# EAGLE design Pluvion 2 - Rev G (EAGLE 7.6.0)

## Sheet 1 of 3
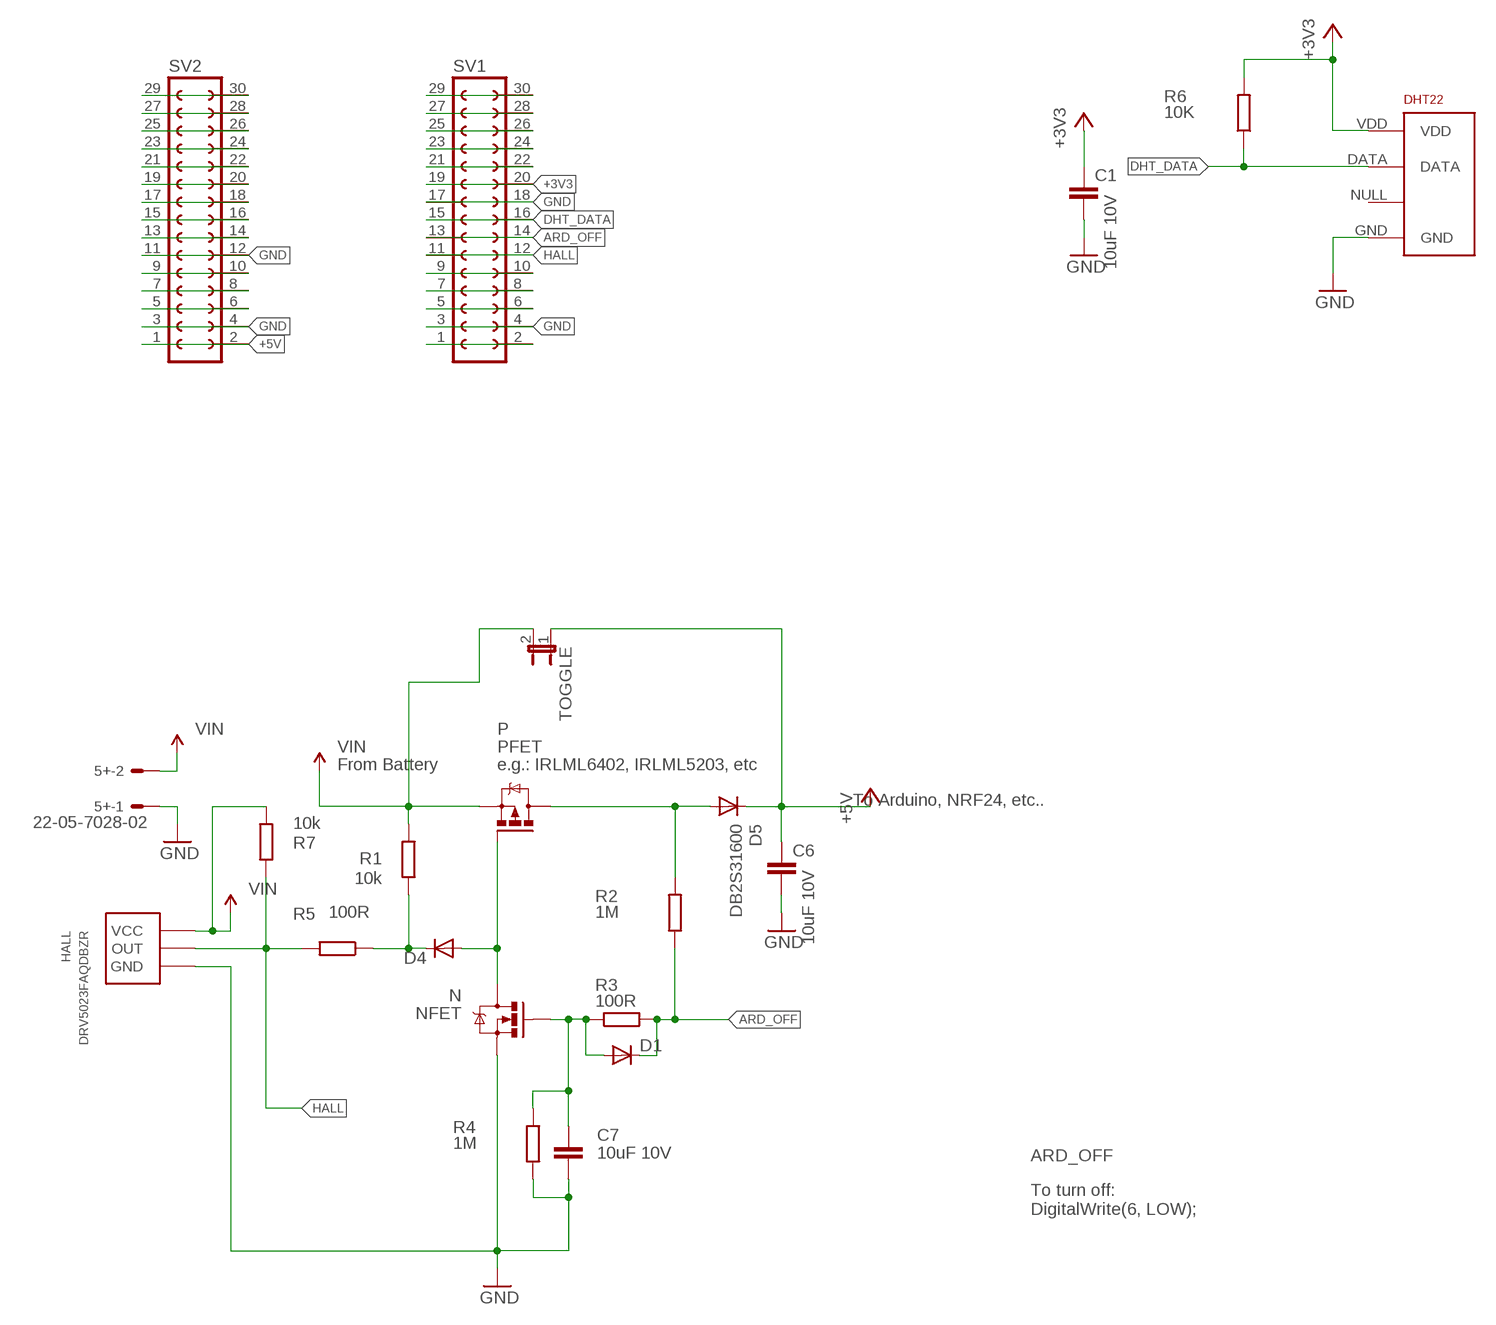
[diagram p0: schematic, sheet 1]

### Parts
5+  22-05-7028-02  [7395-02]
C1  10uF 10V  C-EUC0805  [C0805]
C6  10uF 10V  C-EUC0805  [C0805]
C7  10uF 10V  C-EUC0805  [C0805]
D1  DIODESOD  [SOD-323]
D4  DIODESOD  [SOD-323]
D5  DB2S31600  DIODESMA  [SMA-DIODE]
DHT22  RHT03_DHT-22_AM2302RA  [RHT03_DHT-22/RA]
HALL  DRV5023FAQDBZR  [SOT23]
N  NFET  MOSFET-NCHANNELBSS123LT1G  [SOT23]
P  PFET  IRLML5203  [MICRO3]
R1  10k  R-EU_R0805  [R0805]
R2  1M  R-EU_R0805  [R0805]
R3  100R  R-EU_R0805  [R0805]
R4  1M  R-EU_R0805  [R0805]
R5  100R  R-EU_R0805  [R0805]
R6  10K  R-EU_R0805  [R0805]
R7  10k  R-EU_R0805  [R0805]
SV1  FE15-2  [FE15-2]
SV2  FE15-2  [FE15-2]
TOGGLE  JUMPER-2PTH  [1X02]

### Nets
+3V3: C1.1 DHT22.VDD R6.2 SV1.19 SV1.20
+5V: C6.1 D5.C SV2.1 SV2.2 TOGGLE.1
ARD_OFF: D1.1(C) R2.1 R3.2 SV1.13 SV1.14
BUTTONS: D4.2(A) N.3(D) P.1(G)
DHT_DATA: DHT22.DATA R6.1 SV1.15 SV1.16
GND: 5+.1 C1.2 C6.2 C7.2 DHT22.GND HALL.3(GND) N.2(S) R4.1 SV1.3 SV1.4 SV1.17 SV1.18 SV2.3 SV2.4 SV2.11 SV2.12
HALL: HALL.2(OUT) R5.2 R7.2 SV1.11 SV1.12
N$1: D5.A P.3(D) R2.2
N$2: C7.1 D1.2(A) N.1(G) R3.1 R4.2
N$3: SV1.1 SV1.2
N$5: SV1.5 SV1.6
N$6: SV1.7 SV1.8
N$7: SV1.9 SV1.10
N$8: D4.1(C) R1.1 R5.1
N$12: SV1.21 SV1.22
N$13: SV1.23 SV1.24
N$15: SV1.25 SV1.26
N$16: SV1.27 SV1.28
N$17: SV1.29 SV1.30
N$22: SV2.5 SV2.6
N$23: SV2.7 SV2.8
N$24: SV2.9 SV2.10
N$26: SV2.13 SV2.14
N$27: SV2.15 SV2.16
N$29: SV2.17 SV2.18
N$30: SV2.19 SV2.20
N$31: SV2.21 SV2.22
N$32: SV2.23 SV2.24
N$33: SV2.25 SV2.26
N$34: SV2.27 SV2.28
N$35: SV2.29 SV2.30
VIN: 5+.2 HALL.1(VCC) P.2(S) R1.2 R7.1 TOGGLE.2
Unconnected: DHT22.NULL

### Notes on the sheet
- From Battery | e.g.: IRLML6402, IRLML5203, etc
- To Arduino, NRF24, etc..
- To turn off:
  DigitalWrite(6, LOW);

## Sheet 2 of 3

## Sheet 3 of 3

## Library data of the parts
5+ = con-molex:22-?-02: CONNECTOR wire to board 2.54 mm (.1 inch) pitch header; OC_FARNELL: 9731601; OC_NEWARK: unknown
C1 C6 C7 = wes:C-EU: CAPACITOR, European symbol
D1 D4 = SparkFun-DiscreteSemi:DIODE: Diode These are standard reverse protection diodes and small signal diodes. SMA package can handle up to about 1A. SOD-323 can handle about 200mA. What the SOD-323 package when ordering, there are some mfgs out there that are 5-pin packages.; PROD_ID: DIO-09646
D5 = SparkFun-DiscreteSemi:DIODE: Diode These are standard reverse protection diodes and small signal diodes. SMA package can handle up to about 1A. SOD-323 can handle about 200mA. What the SOD-323 package when ordering, there are some mfgs out there that are 5-pin packages.
DHT22 = RHT03_DHT-22_AM2302:RHT03_DHT-22_AM2302: RHT03 / DHT-22 / AM2302 Packages and symbol for the RHT03 / DHT-22 relative humidity and temperature sensor. Note: The AM2302 is a wired version of the DHT-22 which typically requires less clearance and is thus provided as a separate package.; PROD_ID: SEN-10167
HALL = lib_pluvion:DRV5023FAQDBZR: Digital Switch Hall Sensor
N = SparkFun-DiscreteSemi:MOSFET-NCHANNEL: Common NMOSFET Parts MFG P/N Store ID Prod ID FDD8780 TRANS-09984 SI7820DN TRANS-11055 FDS6630A IC-08089 2N7002PW TRANS-11151 FQP30N06L COM-10213 TRANS-10060 BSS123LT1G TRANS-08345 BSS138 TRANS-00830 BS170 2N7000; PROD_ID: TRANS-08345
P = transistor-power:IRLML5203: HEXFET P-Channel Power MOSFET
R1-R7 = wes:R-EU_: RESISTOR, European symbol
SV1 SV2 = con-lsta:FE15-2: FEMALE HEADER; OC_FARNELL: unknown; OC_NEWARK: unknown
TOGGLE = SparkFun-Passives:JUMPER-2: Jumper Basic 0.1" spaced jumper. Use with breakaway headers.

## Board
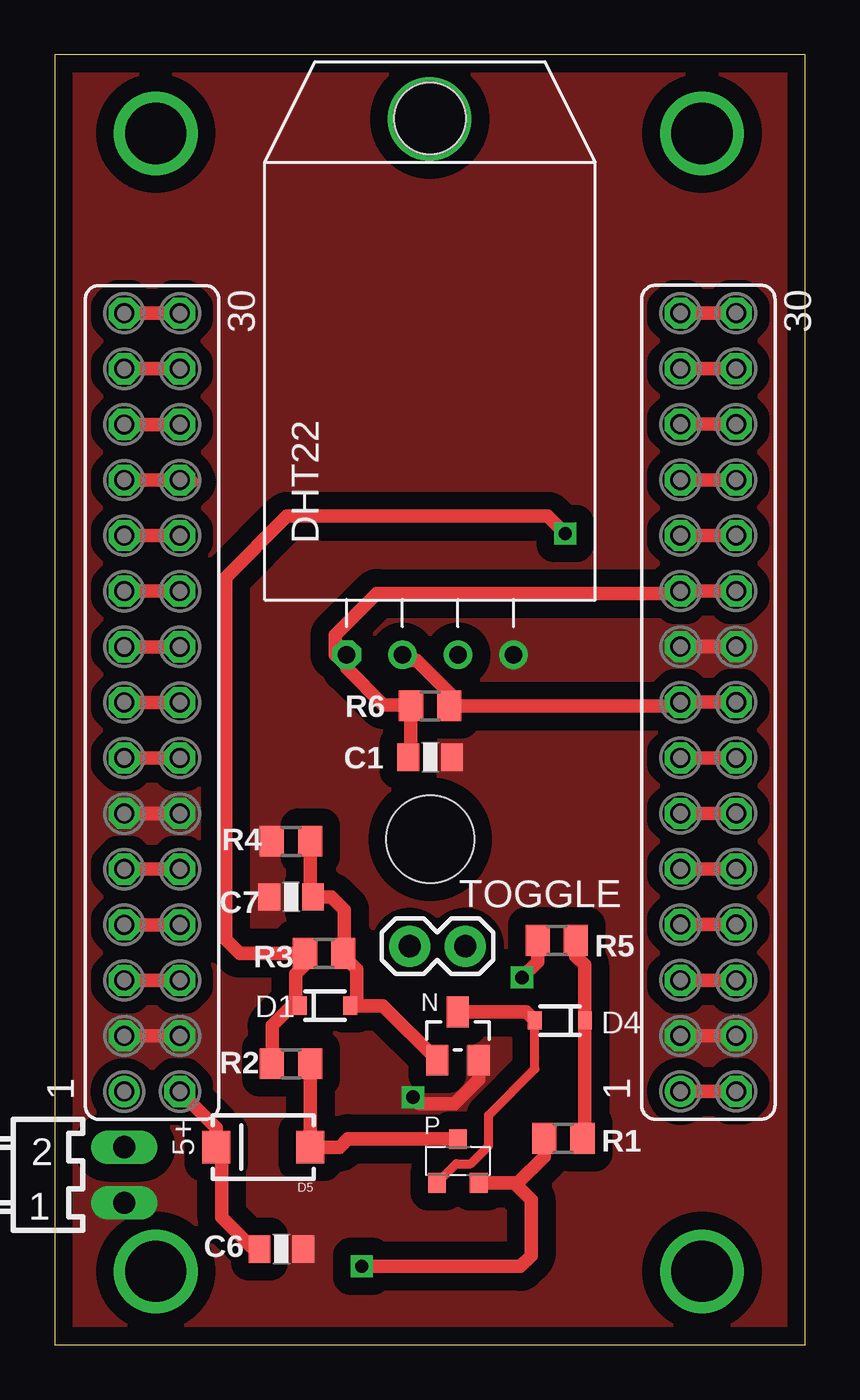
[diagram p1: board, top side]
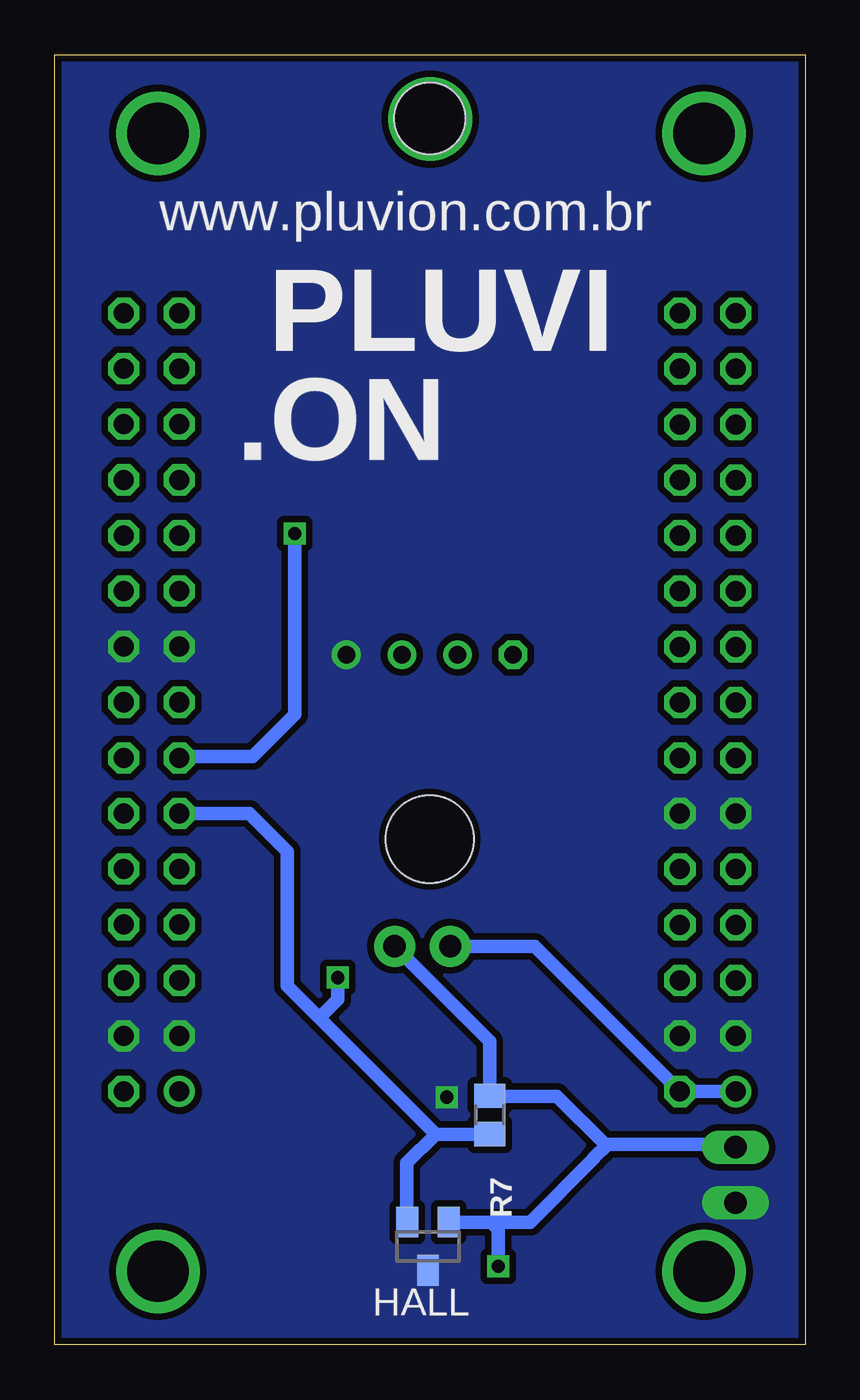
[diagram p2: board, bottom side, seen from below]

Size 34.27 x 58.94 mm. Coordinates in mm from the lower left corner, seen from the top.
Outline: 0,0 34.27,0 34.27,58.94 0,58.94 0,0
Copper layers (1*16): Top 0.035mm / dielectric 1.5mm / Bottom 0.035mm
Design rules "default *": minimum track width 10mil, minimum drill 0.6mm, track to track 8mil, track to pad 8mil, pad to pad 8mil, via to via 8mil, smd to smd 8mil, copper to edge 10mil, drill to drill 8mil, minimum pad ring 10mil, minimum via ring 8mil, stop-mask expansion 4mil, vias tented up to drill 0mil, thermal gap 10mil
Holes 4 mm at 17.14,23.1

### Footprints (pad centres in the part's own frame; a part is rotated, then mirrored left to right if it is on the bottom)
7395-02 = drill 1.016 long: 1 1.27,0; 2 -1.27,0
C0805 = smd 1 x 1.25: 1 -1,0; 2 1,0
SOD-323 = smd 0.63 x 0.83: 1 -1.15,0; 2 1.15,0
SMA-DIODE = smd 1.27 x 1.47: A -2.15,0; C 2.15,0
RHT03_DHT-22/RA = drill 0.8: DATA -1.27,0; GND 3.81,0; NULL 1.27,0 | drill 0.8 octagon: VDD -3.81,0 | hole 3.25: 0,24.5
SOT23 = smd 1 x 1.4: 1 -0.95,-1.1; 2 0.95,-1.1; 3 0,1.1
MICRO3 = smd 0.8 x 0.9: 1 -0.95,-1; 2 0.95,-1; 3 0,1
R0805 = smd 1.1 x 1.4: 1 -0.875,0; 2 0.875,0
FE15-2 = drill 0.914: 1 -17.78,1.27 | drill 0.914 octagon: 2 -17.78,-1.27; 3 -15.24,1.27; 4 -15.24,-1.27; 5 -12.7,1.27; 6 -12.7,-1.27; 7 -10.16,1.27; 8 -10.16,-1.27; 9 -7.62,1.27; 10 -7.62,-1.27; 11 -5.08,1.27; 12 -5.08,-1.27; 13 -2.54,1.27; 14 -2.54,-1.27; 15 0,1.27; 16 0,-1.27; 17 2.54,1.27; 18 2.54,-1.27; 19 5.08,1.27; 20 5.08,-1.27; 21 7.62,1.27; 22 7.62,-1.27; 23 10.16,1.27; 24 10.16,-1.27; 25 12.7,1.27; 26 12.7,-1.27; 27 15.24,1.27; 28 15.24,-1.27; 29 17.78,1.27; 30 17.78,-1.27
1X02 = drill 1.016 pad 1.88: 1 0,0; 2 2.54,0

### Placement (x,y rotation side)
5+  3.17,7.76 270 top
C1  17.14,26.85 0 top
C6  10.35,4.38 0 top
C7  10.79,20.46 180 top
D1  12.34,15.49 0 top
D4  23.07,14.82 180 top
D5  9.53,9.03 180 top
DHT22  17.14,31.53 0 top
HALL  17.23,4.5 180 bottom
N  18.41,14.11 0 top
P  18.41,8.39 0 top
R1  23.23,9.43 180 top
R2  10.79,12.84 0 top
R3  12.3,17.88 180 top
R4  10.79,23 0 top
R5  22.93,18.48 180 top
R6  17.14,29.19 180 top
R7  14.4,10.5 270 bottom
SV1  29.85,29.36 90 top
SV2  4.44,29.35 90 top
TOGGLE  16.21,18.21 0 top

### Tracks (layer width: path | path; a pad name or v marks a point on that pad's centre or on a via)
+3V3
  Top 0.406: R6.2 15.13,29.19 12.81,31.51
  Top 0.61: DHT22.VDD 13.34,30.91 15.01,29.24 16.22,29.24 R6.2 16.27,26.98 C1.1 | SV1.20 SV1.19 28.47,34.33 14.71,34.33 12.81,32.43 12.81,31.51
+5V
  Top 0.61: C6.1 9.07,4.38 7.63,5.82 7.63,8.78 D5.C 7.38,9.91 SV2.2
  Bottom 0.61: TOGGLE.1 12.35,18.21 SV2.2 SV2.1
ARD_OFF  (via drill 0.6)
  Top 0.61: R2.1 9.92,14.58 10.83,15.49 D1.1 11.01,15.67 11.01,16.93 11.43,17.35 R3.2 8.44,17.88 7.8,18.52 7.8,35.06 10.6,37.86 22.52,37.86 v23.32,37.06 | SV1.13 SV1.14
  Bottom 0.61: v23.32,37.06 23.32,28.8 25.24,26.88 28.51,26.88 SV1.13
BUTTONS
  Top 0.406: P.1 17.47,7.39 18.35,8.27 19.01,8.27 19.82,9.08 19.82,10.49 21.93,12.6 D4.2
  Top 0.61: N.3 21.53,15.21 D4.2
DHT_DATA
  Top 0.61: DHT22.DATA 16.15,31.26 16.54,31.26 18.02,29.78 R6.1 28.41,29.19 SV1.15 SV1.16
GND  (via drill 0.6)
  Top 0.61: SV2.3 SV2.4 | SV2.11 SV2.12 | SV1.17 SV1.18 | SV1.3 SV1.4 | N.2 19.36,12.12 18.25,11 16.67,11 v16.36,11.31
  Bottom 0.61: v16.36,11.31 16.36,11.16 16.35,11.16
  pour Top (isolate 0.813, no thermals): -10.16,73.66 90.17,73.66 90.17,-12.7 -10.16,-12.7
  pour Bottom (isolate 0.305, no thermals): -6.35,72.39 43.18,72.39 43.18,-12.7 -6.35,-12.7
HALL  (via drill 0.6)
  Top 0.61: SV1.11 SV1.12 | R5.2 22.05,17.49 v21.34,16.77
  Bottom 0.61: R7.2 16.88,9.62 | 16.88,9.62 18.2,8.31 18.2,5.62 HALL.2 | SV1.11 25.38,24.28 23.65,22.54 23.65,16.39 22.19,14.93 | 22.19,14.93 16.88,9.62 | v21.34,16.77 21.34,15.78 22.19,14.93
N$1
  Top 0.61: P.3 18.39,9.42 13.39,9.42 13.01,9.03 D5.A R2.2
N$2
  Top 0.61: R4.2 11.67,20.59 C7.1 12.64,20.46 13.22,19.87 13.22,17.93 R3.1 13.18,17.77 13.79,17.16 13.79,15.79 D1.2 14.98,15.49 N.1
N$3
  Top 0.61: SV1.1 SV1.2
N$5
  Top 0.61: SV1.5 SV1.6
N$6
  Top 0.61: SV1.7 SV1.8
N$7
  Top 0.61: SV1.9 SV1.10
N$8
  Top 0.61: R1.1 24.22,9.54 D4.1 24.2,14.83 24.2,17.35 23.8,17.75 R5.1
N$9  (via drill 2.8)
  other vias: 4.61,3.35
N$10  (via drill 2.8)
  other vias: 29.56,3.35
N$12
  Top 0.61: SV1.21 SV1.22
N$13
  Top 0.61: SV1.23 SV1.24
N$14  (via drill 2.8)
  other vias: 17.12,23.1
N$15
  Top 0.61: SV1.25 SV1.26
N$16
  Top 0.61: SV1.28 SV1.27
N$17
  Top 0.61: SV1.29 SV1.30
N$18  (via drill 2.8)
  other vias: 4.61,55.35
N$20  (via drill 2.8)
  other vias: 29.56,55.35
N$22
  Top 0.61: SV2.5 SV2.6
N$23
  Top 0.61: SV2.7 SV2.8
N$24
  Top 0.61: SV2.9 SV2.10
N$26
  Top 0.61: SV2.13 SV2.14
N$27
  Top 0.61: SV2.15 SV2.16
N$28  (via drill 2.8)
  other vias: 17.12,56
N$29
  Top 0.61: SV2.17 SV2.18
N$30
  Top 0.61: SV2.19 SV2.20
N$31
  Top 0.61: SV2.21 SV2.22
N$32
  Top 0.61: SV2.23 SV2.24 | SV2.24 6.17,39.51 6.25,39.43 5.79,39.43 SV2.24
N$33
  Top 0.61: SV2.25 SV2.26
N$34
  Top 0.61: SV2.27 SV2.28
N$35
  Top 0.61: SV2.29 SV2.30
VIN  (via drill 0.6)
  Top 0.61: R1.2 22.35,8.59 21.15,7.39 21,7.39 | P.2 21,7.39 | 21,7.39 21.76,6.63 21.76,4.07 21.27,3.58 v14.02,3.58
  Bottom 0.61: HALL.1 14.34,5.6 | 14.34,5.6 12.56,5.6 9.64,8.52 9.64,8.53 9.02,9.15 | 9.02,9.15 3.3,9.15 5+.2 | 9.02,9.15 9.14,9.15 11.34,11.36 14.38,11.36 R7.1 14.4,13.86 TOGGLE.2 | v14.02,3.58 14.02,5.28 14.34,5.6

### Text on the board
bNames: www.pluvion.com.br | PLUVI | .ON